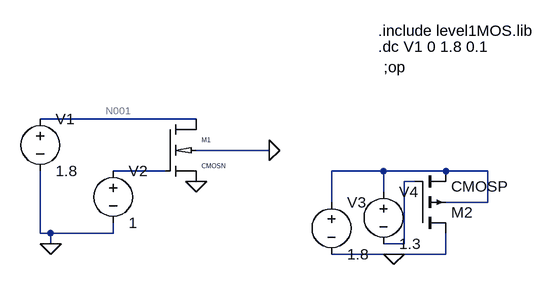
[diagram p0: schematic IdVds.asc]
IdVds.asc, the LTspice schematic file:
Version 4
SHEET 1 884 680
WIRE 64 160 -176 160
WIRE 176 208 64 208
WIRE 16 240 -64 240
WIRE 352 240 272 240
WIRE 448 240 352 240
WIRE 512 240 448 240
WIRE 400 256 384 256
WIRE 352 272 352 240
WIRE 272 288 272 240
WIRE 512 288 512 240
WIRE 512 288 448 288
WIRE -176 336 -176 240
WIRE -160 336 -176 336
WIRE -64 336 -64 320
WIRE -64 336 -160 336
WIRE -160 352 -160 336
WIRE 384 352 384 256
WIRE 384 352 352 352
WIRE 368 368 272 368
WIRE 448 368 448 336
WIRE 448 368 368 368
FLAG 64 256 0
FLAG 176 208 0
FLAG -160 352 0
FLAG 368 368 0
SYMBOL cmosn 16 160 R0
SYMATTR InstName M1
SYMATTR Value2 l=0.36u w=0.72u
SYMBOL voltage -176 144 R0
WINDOW 123 0 0 Left 2
WINDOW 39 0 0 Left 2
SYMATTR InstName V1
SYMATTR Value 1.8
SYMBOL voltage -64 224 R0
WINDOW 123 0 0 Left 2
WINDOW 39 0 0 Left 2
SYMATTR InstName V2
SYMATTR Value 1
SYMBOL cmosp 400 336 M180
SYMATTR InstName M2
SYMATTR Value2 l=0.36u w=3.6u
SYMBOL voltage 272 272 R0
WINDOW 123 0 0 Left 2
WINDOW 39 0 0 Left 2
SYMATTR InstName V3
SYMATTR Value 1.8
SYMBOL voltage 352 256 R0
WINDOW 123 0 0 Left 2
WINDOW 39 0 0 Left 2
SYMATTR InstName V4
SYMATTR Value 1.3
TEXT 344 24 Left 2 !.include level1MOS.lib
TEXT 344 48 Left 2 !.dc V1 0 1.8 0.1
TEXT 352 80 Left 2 !;op

The netlist it stands for:
* IdVds.asc
M1 N001 N002 0 0 CMOSN l=0.36u w=0.72u
V1 N001 0 1.8
V2 N002 0 1
M2 0 N004 N003 N003 CMOSP l=0.36u w=3.6u
V3 N003 0 1.8
V4 N003 N004 1.3
.model NMOS NMOS
.model PMOS PMOS
.lib standard.mos
.include level1MOS.lib
.dc V1 0 1.8 0.1
;op
.lib tsmc018.lib
.backanno
.end

* Results of the author's LTspice run, read from the files saved beside the schematic
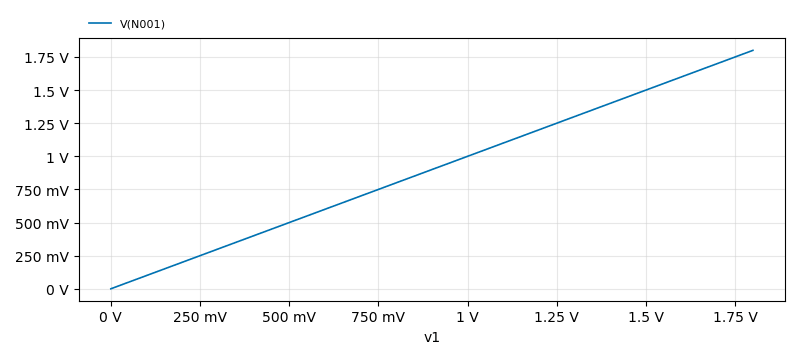
[diagram p1: DC transfer characteristic of IdVds.asc, plotted from the saved traces]
* DC transfer characteristic, 1 run:
*   V(N001): 0 V at v1=0 V, 1.8 V at v1=1.8 V, min 0 V, max 1.8 V